# Altium project LCLP_DLog_V7.PrjPcb (part 1 of 2)
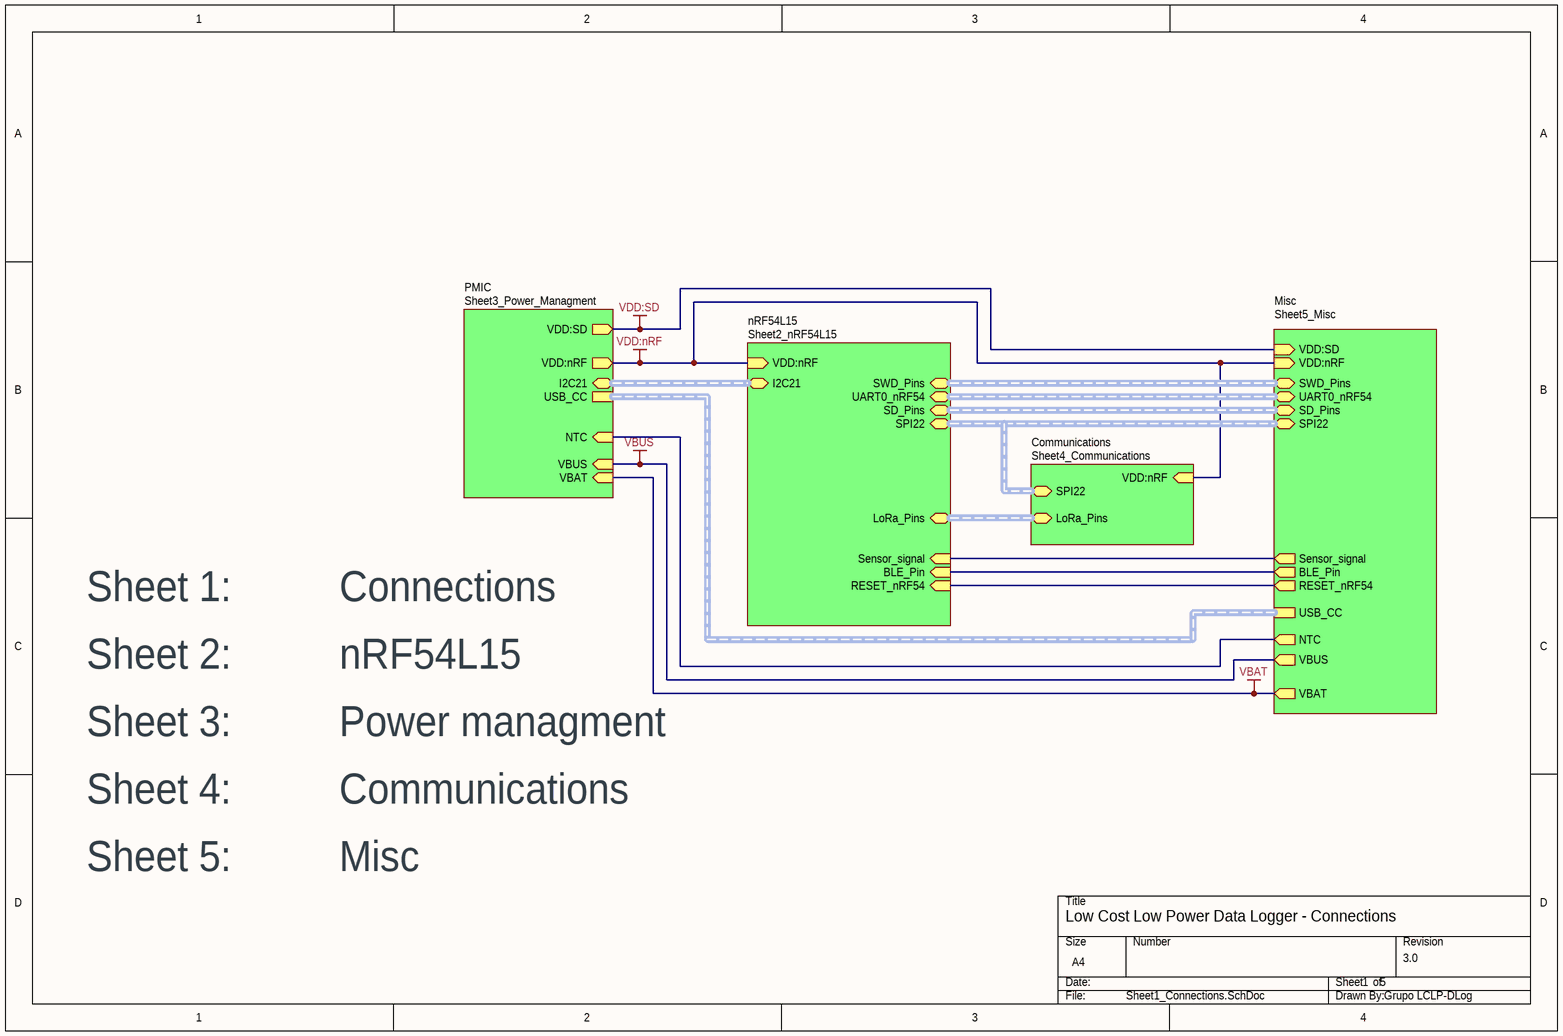
[diagram p0: Sheet1_Connections.SchDoc]
5 sheets, 67 parts. Net scope: hierarchical (ports join the sheet entries above them; power ports are global).
Board file: PCBV2.PcbDoc
Sheets:
  Sheet1_Connections.SchDoc
    nRF54L15 = Sheet2_nRF54L15.SchDoc
    PMIC = Sheet3_Power_Managment.SchDoc
    Communications = Sheet4_Communications.SchDoc
    Misc = Sheet5_Misc.SchDoc

## Sheet Sheet1_Connections.SchDoc
size A4; SheetNumber: 1; SheetTotal: 5

### Sub-sheets
Communications = Sheet4_Communications: SPI22 (bidir), LoRa_Pins (bidir), VDD:nRF (in)
Misc = Sheet5_Misc: SWD_Pins (bidir), UART0_nRF54 (bidir), SD_Pins (bidir), RESET_nRF54 (out), SPI22 (bidir), BLE_Pin (out), Sensor_signal (out), USB_CC, NTC (out), VBUS (out), VBAT (out), VDD:nRF (in), VDD:SD (in)
nRF54L15 = Sheet2_nRF54L15: I2C21 (bidir), SPI22 (bidir), LoRa_Pins (bidir), SD_Pins (bidir), UART0_nRF54 (bidir), SWD_Pins (bidir), RESET_nRF54 (in), Sensor_signal (in), BLE_Pin (in), VDD:nRF (in)
PMIC = Sheet3_Power_Managment: I2C21 (bidir), USB_CC, NTC (in), VBUS (in), VBAT (in), VDD:nRF (out), VDD:SD (out)

### Nets
VBAT: sheet PMIC/VBAT, sheet Misc/VBAT
VBUS: sheet PMIC/VBUS, sheet Misc/VBUS
VDD:nRF: sheet nRF54L15/VDD:nRF, sheet PMIC/VDD:nRF, sheet Communications/VDD:nRF, sheet Misc/VDD:nRF
VDD:SD: sheet PMIC/VDD:SD, sheet Misc/VDD:SD
nRF54_RESET: sheet nRF54L15/RESET_nRF54, sheet Misc/RESET_nRF54
NTC_IN: sheet PMIC/NTC, sheet Misc/NTC
P0.04: sheet nRF54L15/Sensor_signal, sheet Misc/Sensor_signal
P1.13: sheet nRF54L15/BLE_Pin, sheet Misc/BLE_Pin

### Buses and harness runs
harness sheet Communications/LoRa_Pins = sheet nRF54L15/LoRa_Pins
harness sheet Communications/SPI22 = sheet Misc/SPI22 = sheet nRF54L15/SPI22
harness sheet Misc/SD_Pins = sheet nRF54L15/SD_Pins
harness sheet Misc/SWD_Pins = sheet nRF54L15/SWD_Pins
harness sheet Misc/UART0_nRF54 = sheet nRF54L15/UART0_nRF54
harness sheet Misc/USB_CC = sheet PMIC/USB_CC
harness sheet nRF54L15/I2C21 = sheet PMIC/I2C21

### Notes on the sheet
- Sheet 1:          Connections
- Sheet 2:          nRF54L15
- Sheet 3:          Power managment
- Sheet 4:          Communications
- Sheet 5:          Misc
- Low Cost Low Power Data Logger - Connections
- 1
- 5
- 3.0
- Grupo LCLP-DLog

## Sheet Sheet2_nRF54L15.SchDoc
size A4; SheetNumber: 2; SheetTotal: 5
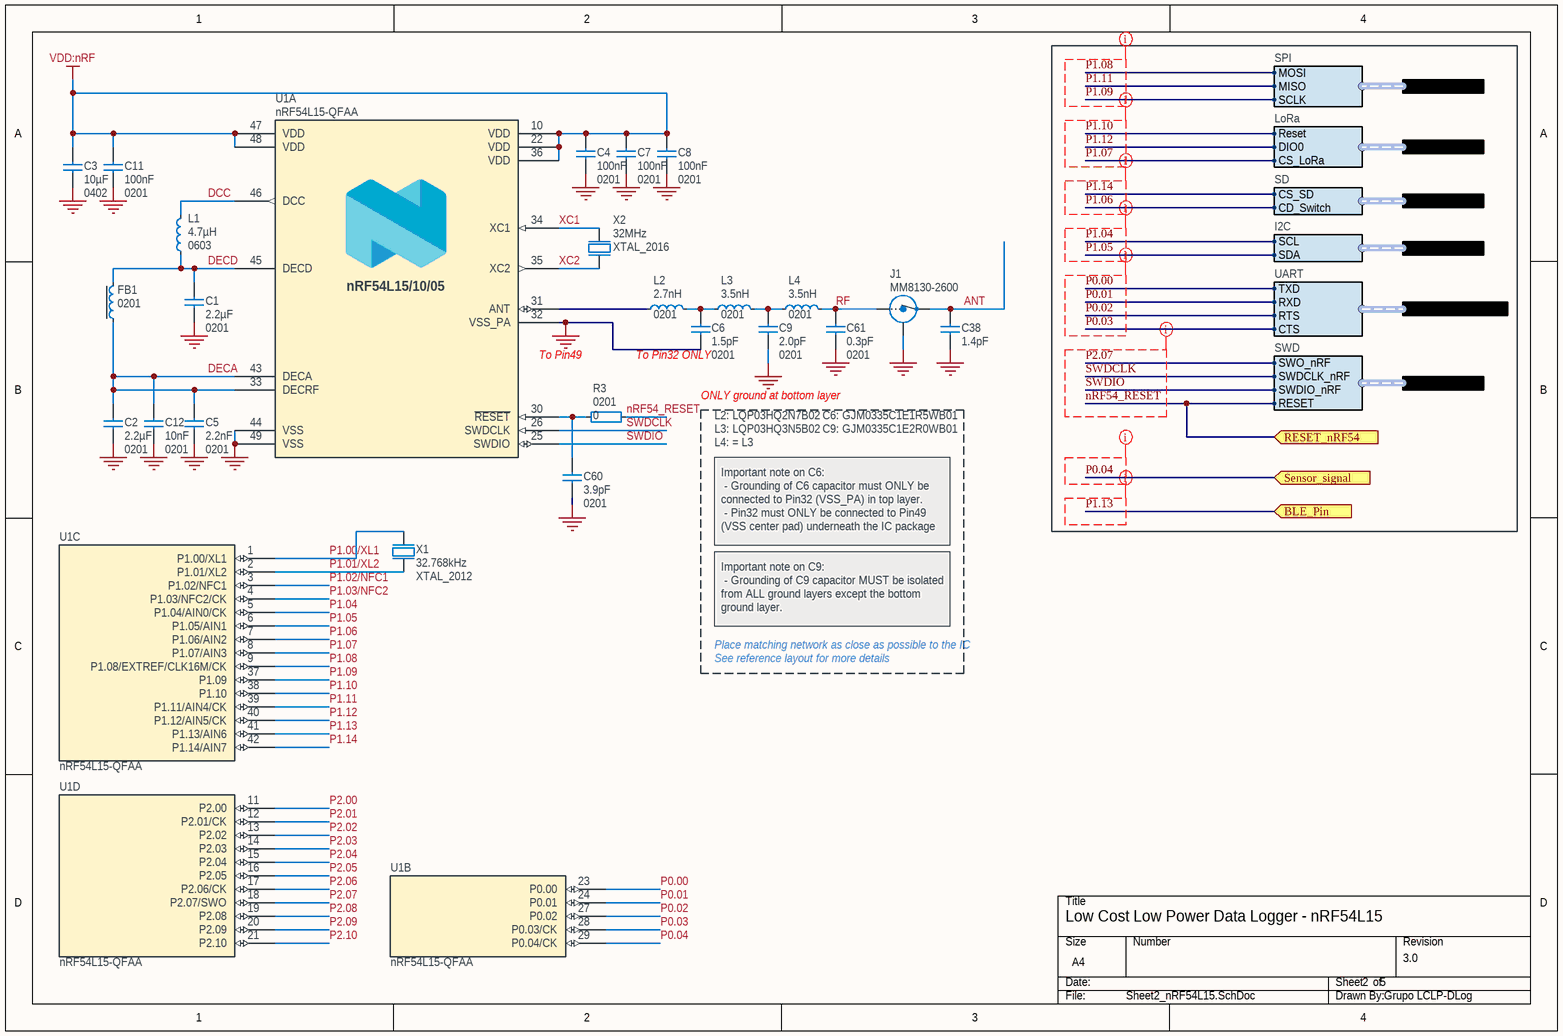
[diagram p1: Sheet2_nRF54L15.SchDoc]

### Parts
C1  2.2µF  Footprint Doc: 0201  [CAPC0603X03L_C]
C2  2.2µF  Footprint Doc: 0201  [CAPC0603X03L_C]
C3  10µF  Footprint Doc: 0402  [CAPC1005X04L]
C4  100nF  Footprint Doc: 0201  [CAPC0603X03L_C]
C5  2.2nF  Footprint Doc: 0201  [CAPC0603X03L_C]
C6  1.5pF  Footprint Doc: 0201  [CAPC0603X03L_C]
C7  100nF  Footprint Doc: 0201  [CAPC0603X03L_C]
C8  100nF  Footprint Doc: 0201  [CAPC0603X03L_C]
C9  2.0pF  Footprint Doc: 0201  [CAPC0603X03L_C]
C11  100nF  Footprint Doc: 0201  [CAPC0603X03L_C]
C12  10nF  Footprint Doc: 0201  [CAPC0603X03L_C]
C38  1.4pF  [CAPC0603X03L_C]
C60  3.9pF  Footprint Doc: 0201  [CAPC0603X03L_C]
C61  0.3pF  Footprint Doc: 0201  [CAPC0603X03L_C]
FB1  Footprint Doc: 0201  [INDC0603X03L_C]  (hidden comment: 120R/0.2A)
J1  MM8130-2600  [COAXIAL-SWF]
L1  4.7µH  Footprint Doc: 0603  [INDC1608X06L]
L2  2.7nH  Footprint Doc: 0201  [INDC0603X03L_C]
L3  3.5nH  Footprint Doc: 0201  [INDC0603X03L_C]
L4  3.5nH  Footprint Doc: 0201  [INDC0603X03L_C]
R3  0  Footprint Doc: 0201  [RESC0603X03L_C]
U1  nRF54L15-QFAA  [QFN40P600X600X90-48N]  (parts A,B,C,D of 4)
X1  32.768kHz  [XTAL_2012]
X2  32MHz  Footprint Doc: XTAL_2016  [BT-XTAL_2016]

### Ports
BLE_Pin (in, see Sheet1_Connections[3C], Sheet5_Misc[1C]), I2C21 (harness I2C, see Sheet1_Connections[2B], Sheet3_Power_Managment[1C]), LoRa_Pins (harness LoRa, see Sheet1_Connections[3C], Sheet4_Communications[2B]), RESET_nRF54 (in, see Sheet1_Connections[3C], Sheet5_Misc[1C]), SD_Pins (harness SD, see Sheet1_Connections[3B], Sheet5_Misc[2B]), Sensor_signal (in, see Sheet1_Connections[3C], Sheet5_Misc[1D]), SPI22 (harness SPI, see Sheet1_Connections[3B], Sheet4_Communications[2B], Sheet5_Misc[2A]), SWD_Pins (harness SWD, see Sheet1_Connections[3B], Sheet5_Misc[3A]), UART0_nRF54 (harness UART, see Sheet1_Connections[3B], Sheet5_Misc[2C])

### Harnesses
SPI: MISO, MOSI, SCLK
LoRa: DIO0, Reset, CS_LoRa
SD: CD_Switch, CS_SD
UART: RXD, TXD, RTS, CTS
I2C: SDA, SCL
SWD: SWDIO_nRF, SWDCLK_nRF, SWO_nRF, RESET

### Nets
GND: C1.1 C2.1 C3.1 C4.2 C5.1 C6.1 C7.2 C8.2 C9.1 C11.2 C12.1 C38.1 C60.1 C61.1 J1.2(Shield) U1.32(VSS_PA) U1.44(VSS) U1.49(VSS) X2.2(GND) X2.4(GND)
VDD:nRF: C3.2 C4.1 C7.1 C8.1 C11.1 U1.10(VDD) U1.22(VDD) U1.36(VDD) U1.47(VDD) U1.48(VDD)
ANT: C38.2 J1.3(OUT)
DCC: L1.1 U1.46(DCC)
DECA: C2.2 C5.2 C12.2 FB1.2 U1.33(DECRF) U1.43(DECA)
DECD: C1.2 FB1.1 L1.2 U1.45(DECD)
nRF54_RESET: R3.2 ; port RESET_nRF54, port SWD_Pins.RESET
P0.00: U1.23(P0.00) ; port UART0_nRF54.TXD
P0.01: U1.24(P0.01) ; port UART0_nRF54.RXD
P0.02: U1.27(P0.02) ; port UART0_nRF54.RTS
P0.03: U1.28(P0.03/CK) ; port UART0_nRF54.CTS
P0.04: U1.29(P0.04/CK) ; port Sensor_signal
P1.00/XL1: U1.1(P1.00/XL1) X1.2(out)
P1.01/XL2: U1.2(P1.01/XL2) X1.1(inp)
P1.02/NFC1: U1.3(P1.02/NFC1)
P1.03/NFC2: U1.4(P1.03/NFC2/CK)
P1.04: U1.5(P1.04/AIN0/CK) ; port I2C21.SCL
P1.05: U1.6(P1.05/AIN1) ; port I2C21.SDA
P1.06: U1.7(P1.06/AIN2) ; port SD_Pins.CD_Switch
P1.07: U1.8(P1.07/AIN3) ; port LoRa_Pins.CS_LoRa
P1.08: U1.9(P1.08/EXTREF/CLK16M/CK) ; port SPI22.MOSI
P1.09: U1.37(P1.09) ; port SPI22.SCLK
P1.10: U1.38(P1.10) ; port LoRa_Pins.Reset
P1.11: U1.39(P1.11/AIN4/CK) ; port SPI22.MISO
P1.12: U1.40(P1.12/AIN5/CK) ; port LoRa_Pins.DIO0  [project net DIO0_LoRa]
P1.13: U1.41(P1.13/AIN6) ; port BLE_Pin
P1.14: U1.42(P1.14/AIN7) ; port SD_Pins.CS_SD
P2.00: U1.11(P2.00)
P2.01: U1.12(P2.01/CK)
P2.02: U1.13(P2.02)
P2.03: U1.14(P2.03)
P2.04: U1.15(P2.04)
P2.05: U1.16(P2.05)
P2.06: U1.17(P2.06/CK)
P2.07: U1.18(P2.07/SWO) ; port SWD_Pins.SWO_nRF
P2.08: U1.19(P2.08)
P2.09: U1.20(P2.09)
P2.10: U1.21(P2.10)
RF: C61.2 J1.1(IN) L4.2
SWDCLK: U1.26(SWDCLK) ; port SWD_Pins.SWDCLK_nRF
SWDIO: U1.25(SWDIO) ; port SWD_Pins.SWDIO_nRF
XC1: U1.34(XC1) X2.1(inp)
XC2: U1.35(XC2) X2.3(out)
NetC6_2: C6.2 L2.2 L3.1
NetC9_2: C9.2 L3.2 L4.1
NetC60_2: C60.2 R3.1 U1.30(~{RESET})
NetL2_1: L2.1 U1.31(ANT)

### Layout directives
net class BUTTONS: nRF54_RESET, P0.00, P0.01, P0.02, P0.03, P0.04, P1.04, P1.05, P1.06, P1.07, P1.08, P1.09, P1.10, P1.11, P1.12, P1.13, P1.14, P2.07, SWDCLK, SWDIO

### Notes on the sheet
- (near U1) To Pin49
- (near C6) To Pin32 ONLY
- ONLY ground at bottom layer
- L2: LQP03HQ2N7B02
- L3: LQP03HQ3N5B02
- L4: = L3
- C6: GJM0335C1E1R5WB01
- C9: GJM0335C1E2R0WB01
- Important note on C6:
  - Grounding of C6 capacitor must ONLY be connected to Pin32 (VSS_PA) in top layer.
  - Pin32 must ONLY be connected to Pin49 (VSS center pad) underneath the IC package
- Place matching network as close as possible to the IC
- Important note on C9:
  - Grounding of C9 capacitor MUST be isolated from ALL ground layers except the bottom ground layer.
- See reference layout for more details
- Low Cost Low Power Data Logger - nRF54L15
- 2
- 5
- 3.0
- Grupo LCLP-DLog
- (in symbol nRF54L15-QFAAC00, part A) nRF54L15/10/05

### Library data of the parts
C1 C2 = C0201-2µ2-2.5V-X6T-GRM033D80E225ME47D: Capacitor, Ceramic, 2.2µF 2.5V X6T 0201,±20%; Manufacturer: Murata; Manufacturer Part Number: GRM033R61A225KE47; Part number NEMS: 100200527; Component Status: Active; Pad Count: 2; Note: 2.5V, 20%, X6T; Artikkelnr Noca: N.A.; Part Number: C0201-2µ2-2.5V-X6T-GRM033D80E225ME47D; Component Class: Capacitors; Author: stl1; ComponentLink1URL: https://www.murata.com/products/productdetail?partno=GRM033D80E225ME47%23; ComponentLink1Description: Datasheet; ComponentLink2URL: N.A.; ComponentLink2Description: Supplier link; HelpURL: N.A.; LatestRevisionDate: 2022-02-27; Published: 2022-02-27; Value: 2.2µF; Supplier 1: Mouser; Supplier Part Number 1: 81-GRM033D80E225ME7D; Supplier 2: Digi-Key; Supplier Part Number 2: 490-18653-1-ND; Part number IPS: N.A.; Part number Norautron: N.A.; PartId: 100200527
C3 = C0402-10µF-6.3V-X6S: Capacitor, X6S, ±20%, 6.3V; Manufacturer: N.A.; Part number NEMS: 100200478; Component Status: Active; Pad Count: 2; Part Number: C0402-10µF-6.3V-X6S; PartId: 100200478; Component Class: Capacitors; Author: getr; Manufacturer Part Number: N.A.; ComponentLink1URL: N.A.; ComponentLink1Description: Datasheet; ComponentLink2URL: N.A.; ComponentLink2Description: Supplier link; HelpURL: N.A.; LatestRevisionDate: 2021-06-25; Published: 2021-06-25; Value: 10µF; Note: 6.3V; Supplier 1: N.A.; Supplier Part Number 1: N.A.; Supplier 2: N.A.; Supplier Part Number 2: N.A.; Artikkelnr Noca: N.A.; Part number IPS: N.A.; Part number Norautron: N.A.
C4 C7 C8 C11 = C0201-100n-10V-X7R: Capacitor, X7R, ±10%; Manufacturer: N.A.; Part number NEMS: 100200469; Note: 10V; Pad Count: 2; Component Status: Active; Part Number: C0201-100n-10V-X7R; Manufacturer Part Number: N.A.; LatestRevisionDate: 2021-04-12; Published: 2021-04-12; Value: 100nF; Artikkelnr Noca: N.A.; Part number IPS: N.A.; ComponentLink1URL: N.A.; ComponentLink1Description: Datasheet; ComponentLink2URL: N.A.; ComponentLink2Description: Supplier link; HelpURL: N.A.; Supplier 1: N.A.; Supplier Part Number 1: N.A.; Supplier 2: N.A.; Supplier Part Number 2: N.A.; Component Class: Capacitors; Author: getr; Part number Norautron: N.A.; PartId: 100200469
C5 = C0201-2n2: Capacitor, X7R, ±10%, 10V; Manufacturer: N.A.; Part number IPS: 00000001778; Part number Norautron: 26470002; Part number NEMS: 100200060; Component Status: Active; Pad Count: 2; Part Number: C0201-2n2; PartId: 100200060; Component Class: Capacitors; Author: rsk; Manufacturer Part Number: N.A.; ComponentLink1URL: N.A.; ComponentLink1Description: Datasheet; ComponentLink2URL: N.A.; ComponentLink2Description: Supplier link; HelpURL: N.A.; LatestRevisionDate: 2014-11-13; Published: 2014-11-13; Value: 2.2nF; Note: 10V; Supplier 1: N.A.; Supplier Part Number 1: N.A.; Supplier 2: N.A.; Supplier Part Number 2: N.A.; Artikkelnr Noca: N.A.
C6 = C0201-1.5p-25V-NP0-GJM0335C1E1R5WB01: Capacitor, NP0, ±0.05pF, 25V, High Q; Manufacturer: Murata; Part number NEMS: 100200477; Component Status: Active; Pad Count: 2; Artikkelnr Noca: N.A.; Part Number: C0201-1.5p-25V-NP0-GJM0335C1E1R5WB01; PartId: 100200477; Component Class: Capacitors; Author: masi; Manufacturer Part Number: GJM0335C1E1R5WB01; ComponentLink1URL: https://search.murata.co.jp/Ceramy/image/img/A01X/G101/ENG/GJM0335C1E1R5WB01-01.pdf; ComponentLink1Description: Datasheet; ComponentLink2URL: N.A.; ComponentLink2Description: Supplier link; HelpURL: https://www.murata.com/products/productdetail?partno=GJM0335C1E1R5WB01%23; LatestRevisionDate: 2021-06-15; Published: 2021-06-15; Value: 1.5pF; Note: 25V; Supplier 1: Digi-Key; Supplier Part Number 1: 490-11176-2-ND; Supplier 2: Mouser; Supplier Part Number 2: 81-GJM0335C1E1R5WB1D; Part number IPS: N.A.; Part number Norautron: N.A.
C9 = C0201-2.0p-HQ-Murata: Capacitor, NP0, ±0.05pF, 25V; Manufacturer: Murata; Manufacturer Part Number: GJM0335C1E2R0WB01; Part number IPS: 00000001775; Part number NEMS: 100200419; Component Status: Active; Pad Count: 2; Artikkelnr Noca: N.A.; Part Number: C0201-2.0p-HQ-Murata; PartId: 100200419; Component Class: Capacitors; Author: rsk; ComponentLink1URL: N.A.; ComponentLink1Description: Datasheet; ComponentLink2URL: N.A.; ComponentLink2Description: Supplier link; HelpURL: https://psearch.en.murata.com/capacitor/product/GJM0335C1E2R0WB01%23.html; LatestRevisionDate: 2018-10-25; Published: 2018-10-25; Value: 2.0pF; Note: 25V; Supplier 1: N.A.; Supplier Part Number 1: N.A.; Supplier 2: N.A.; Supplier Part Number 2: N.A.; Part number Norautron: N.A.
C12 = C0201-10n-6.3V-X7R: Capacitor, X7R, 6.3V; Manufacturer: Murata; Manufacturer Part Number: GRM033R70J103KA01D; Part number NEMS: 100200407; Component Status: Active; Pad Count: 2; Artikkelnr Noca: N.A.; Part Number: C0201-10n-6.3V-X7R; PartId: 100200407; Component Class: Capacitors; Author: rsk; ComponentLink1URL: http://search.murata.co.jp/Ceramy/image/img/A01X/G101/ENG/GRM033R70J103KA01-01.pdf; ComponentLink1Description: Datasheet; ComponentLink2URL: N.A.; ComponentLink2Description: Supplier link; HelpURL: N.A.; LatestRevisionDate: 2020-10-13; Published: 2018-05-07; Value: 10nF; Note: 6.3V; Supplier 1: Digi-Key; Supplier Part Number 1: 490-1262-1-ND; Supplier 2: N.A.; Supplier Part Number 2: N.A.; Part number IPS: N.A.; Part number Norautron: N.A.
C38 = C0201-1.4p-25V-GJM0335C1E1R4WB01D: Capacitor, C0G, ±0.05pF, 25V; Manufacturer: Murata; Part number NEMS: 100200553; Pad Count: 2; Artikkelnr Noca: N.A.; Component Status: Active; Part Number: C0201-1.4p-25V-GJM0335C1E1R4WB01D; PartId: 100200553; Component Class: Capacitors; Author: stl1; Manufacturer Part Number: GJM0335C1E1R4WB01D; ComponentLink1URL: https://www.murata.com/products/productdetail?partno=GJM0335C1E1R4WB01%23; ComponentLink1Description: Datasheet; ComponentLink2URL: N.A.; ComponentLink2Description: Supplier link; HelpURL: N.A.; Footprint Doc: 0201; LatestRevisionDate: 2023-05-30; Published: 2023-05-30; Value: 1.4pF; Note: 25V; Supplier 1: Digi-Key; Supplier Part Number 1: 490-GJM0335C1E1R4WB01DTR-ND; Supplier 2: Mouser; Supplier Part Number 2: 81-GJM0335C1E1R4WB1D; Part number IPS: N.A.; Part number Norautron: N.A.
C60 = C0201-3.9p: Chip Cap 0201; Manufacturer: N.A.; Part number NEMS: 100200024; Component Status: Active; Pad Count: 2; Note: Chip Cap 1%; Part Number: C0201-3.9p; PartId: 100200024; Component Class: Capacitors; Author: rsk; Manufacturer Part Number: N.A.; ComponentLink1URL: N.A.; ComponentLink1Description: Datasheet; ComponentLink2URL: N.A.; ComponentLink2Description: Supplier link; HelpURL: N.A.; LatestRevisionDate: 2014-11-13; Published: 2014-11-13; Value: 3.9pF; Supplier 1: N.A.; Supplier Part Number 1: N.A.; Supplier 2: N.A.; Supplier Part Number 2: N.A.; Artikkelnr Noca: N.A.; Part number IPS: N.A.; Part number Norautron: N.A.
C61 = C0201-0.3p-50V-GRM0335C1HR30BA01: Capacitor, C0G, ±0.1pF, 50V; Manufacturer: Murata; Part number NEMS: 100200650; Component Status: Active; Pad Count: 2; Artikkelnr Noca: N.A.; Part Number: C0201-0.3p-50V-GRM0335C1HR30BA01; PartId: 100200650; Component Class: Capacitors; Author: masi; Manufacturer Part Number: GRM0335C1HR30BA01; ComponentLink1URL: https://www.murata.com/en-global/products/productdetail?partno=GRM0335C1HR30BA01%23; ComponentLink1Description: Datasheet; ComponentLink2URL: N.A.; ComponentLink2Description: Supplier link; HelpURL: N.A.; LatestRevisionDate: 2024-01-10; Published: 2024-01-10; Value: 0.3pF; Note: 50V; Supplier 1: Digi-Key; Supplier Part Number 1: 490-6135-2-ND; Supplier 2: Mouser; Supplier Part Number 2: 81-GRM0335C1HR30BA1D; Part number IPS: N.A.; Part number Norautron: N.A.
FB1 = FB0201-120R@100M-200mA-BLM03AG121SN1D: Ferrite Bead, 120 Ohm @ 100MHz, 200mA, 500 mOhm Max; Manufacturer: Murata; Part number NEMS: 100300419; Component Status: Active; Pad Count: 2; Artikkelnr Noca: N.A.; Part Number: FB0201-120R@100M-200mA-BLM03AG121SN1D; Component Class: Inductors; Author: stl1; Manufacturer Part Number: BLM03AG121SN1D; ComponentLink1URL: https://www.murata.com/en-eu/products/productdetail?partno=BLM03AG121SN1%23; ComponentLink1Description: Datasheet; ComponentLink2URL: N.A.; ComponentLink2Description: Supplier link; HelpURL: N.A.; LatestRevisionDate: 2022-02-27; Published: 2022-02-27; Value: 120R/0.2A; Note: Ferrite Bead; Supplier 1: Digi-Key; Supplier Part Number 1: 490-5622-1-ND; Supplier 2: Mouser; Supplier Part Number 2: 81-BLM03AX121SN1D; Part number IPS: N.A.; Part number Norautron: N.A.; PartId: 100300419
J1 = MM8130-2600: Coaxial Connector with Switch; Manufacturer: Murata; Part number IPS: 00000009955; Part number Norautron: 26030338; Part number NEMS: 100500400; Component Status: Active; Pad Count: 3; Note: N.A.; Artikkelnr Noca: 55029011; Part Number: MM8130-2600; PartId: 100500400; Component Class: Connectors; Author: rsk; Manufacturer Part Number: MM8130-2600; ComponentLink1URL: N.A.; ComponentLink1Description: Datasheet; ComponentLink2URL: N.A.; ComponentLink2Description: Supplier link; HelpURL: http://www.murata.com/products/catalog/pdf/o33e.pdf; LatestRevisionDate: 2014-04-24; Published: 2014-04-24; Footprint Doc: COAXIAL-SWF; Value: MM8130-2600; Supplier 1: Digi-Key; Supplier Part Number 1: 490-4981-1-ND; Supplier 2: Mouser; Supplier Part Number 2: 81-MM8130-2600RA2; System: Connector
L1 = L0603-4µ7-MLZ1608M4R7WT000: Inductor, 120mA, ±20%, 0.65R; Manufacturer: TDK Corporation; Part number NEMS: 100300440; Component Status: Active; Pad Count: 2; Note: Power Inductor ±20%; Artikkelnr Noca: N.A.; Part Number: L0603-4µ7-MLZ1608M4R7WT000; PartId: 100300440; Component Class: Inductors; Author: stl1; Manufacturer Part Number: MLZ1608M4R7WT000; ComponentLink1URL: https://product.tdk.com/en/search/inductor/inductor/smd/info?part_no=MLZ1608M4R7WT000; ComponentLink1Description: Datasheet; ComponentLink2URL: N.A.; ComponentLink2Description: Supplier link; HelpURL: N.A.; LatestRevisionDate: 2023-05-10; Published: 2023-05-10; Value: 4.7µH; Supplier 1: Digi-Key; Supplier Part Number 1: 445-6390-2-ND; Supplier 2: Mouser; Supplier Part Number 2: 810-MLZ1608M4R7WT000; Part number IPS: N.A.; Part number Norautron: N.A.
L2 = L0201-2n7-HQ-Murata: Inductor, 600mA, ±0.1ｎH, 120mOhm; Manufacturer: Murata; Manufacturer Part Number: LQP03HQ2N7B02; Part number IPS: 00000001753; Part number NEMS: 100300214; Component Status: Active; Pad Count: 2; Note: -55°C ~ 125°C; Artikkelnr Noca: N.A.; Part Number: L0201-2n7-HQ-Murata; PartId: 100300214; Component Class: Inductors; Author: rsk; ComponentLink1URL: https://search.murata.co.jp/Ceramy/image/img/P02/JELF243C-0021.pdf; ComponentLink1Description: Datasheet; ComponentLink2URL: N.A.; ComponentLink2Description: Supplier link; HelpURL: https://psearch.en.murata.com/inductor/product/LQP03HQ2N7B02%23.html; LatestRevisionDate: 2018-10-23; Published: 2018-10-23; Value: 2.7nH; Supplier 1: Digi-Key; Supplier Part Number 1: 490-13909-1-ND; Supplier 2: N.A.; Supplier Part Number 2: N.A.; Part number Norautron: N.A.
L3 L4 = L0201-3n5-HQ-Murata: Inductor, 500mA, ±0.1ｎH, 170mOhm; Manufacturer: Murata; Manufacturer Part Number: LQP03HQ3N5B02; Part number NEMS: 100300222; Component Status: Active; Pad Count: 2; Note: -55°C ~ 125°C; Artikkelnr Noca: N.A.; Part Number: L0201-3n5-HQ-Murata; PartId: 100300222; Component Class: Inductors; Author: rsk; ComponentLink1URL: https://search.murata.co.jp/Ceramy/image/img/P02/JELF243C-0021.pdf; ComponentLink1Description: Datasheet; ComponentLink2URL: N.A.; ComponentLink2Description: Supplier link; HelpURL: https://psearch.en.murata.com/inductor/product/LQP03HQ3N5B02%23.html; LatestRevisionDate: 2018-10-23; Published: 2018-10-23; Value: 3.5nH; Supplier 1: Digi-Key; Supplier Part Number 1: 490-13925-1-ND; Supplier 2: N.A.; Supplier Part Number 2: N.A.; Part number IPS: N.A.; Part number Norautron: N.A.
R3 = R0201-1k0: Resistor, ±1%, 0.05W; Manufacturer: N.A.; Part number IPS: 00000005786; Part number NEMS: 100100043; Component Status: Active; Pad Count: 2; Value: 1k; Note: Chip Res 1%; Part Number: R0201-1k0; PartId: 100100043; Component Class: Resistors; Author: rsk; Manufacturer Part Number: N.A.; ComponentLink1URL: N.A.; ComponentLink1Description: Datasheet; ComponentLink2URL: N.A.; ComponentLink2Description: Supplier link; HelpURL: N.A.; LatestRevisionDate: 2014-11-13; Published: 2014-11-13; Supplier 1: N.A.; Supplier Part Number 1: N.A.; Supplier 2: N.A.; Supplier Part Number 2: N.A.; Artikkelnr Noca: N.A.; Part number Norautron: N.A.
U1 = nRF54L15-QFAAC00: Multi-protocol Bluetooth Low Energy, IEEE 802.15.4 and 2.4GHz proprietary Wireless MCU; Manufacturer: Nordic Semiconductor; Part number NEMS: 102000382; Component Status: Active; Pad Count: 49; Note: N.A.; Part Number: nRF54L15-QFAAC00; Component Class: Nordic_Devices; Author: stl1; Manufacturer Part Number: nRF54L15-QFAAC00; ComponentLink1URL: N.A.; ComponentLink1Description: Datasheet; ComponentLink2URL: N.A.; ComponentLink2Description: Supplier link; HelpURL: N.A.; LatestRevisionDate: 2025-01-30; Published: 2025-01-30; Footprint Doc: QFN-48; Value: nRF54L15-QFAA; Supplier 1: Nordic Semiconductor; Supplier Part Number 1: nRF54L15-QFAAC00; Supplier 2: N.A.; Supplier Part Number 2: N.A.; Artikkelnr Noca: N.A.; Part number IPS: N.A.; Part number Norautron: N.A.; PartId: 102000382
X1 = XTAL_SMD2012_32.768kHz_9pF_TXC: XTAL SMD 2012, 32.768kHz, 9pF, ±20ppm; Manufacturer: TXC Corporation; Manufacturer Part Number: 9HT11-32.768KDZC-T; Part number NEMS: 101600107; Component Status: Active; Pad Count: 2; Note: XTAL SMD 32.768kHz; Artikkelnr Noca: N.A.; Part Number: XTAL_SMD2012_32.768kHz_9pF_TXC; PartId: 101600107; Component Class: Oscillators; Author: eisk; ComponentLink1URL: http://www.txccrystal.com/images/pdf/9ht11.pdf; ComponentLink1Description: Datasheet; ComponentLink2URL: https://www.digikey.com/en/products/detail/9HT11-32.768KDZC-T/887-1426-1-ND/2403277; ComponentLink2Description: Supplier link; HelpURL: http://www.txccrystal.com/images/pdf/9ht11.pdf; LatestRevisionDate: 2023-03-14; Published: 2014-03-28; Footprint Doc: XTAL_2012; Value: 32.768kHz; Supplier 1: Digi-Key; Supplier Part Number 1: 887-1426-2-ND; Supplier 2: Mouser; Supplier Part Number 2: 717-9HT11-32.7KDZC-T; Part number IPS: N.A.; Part number Norautron: N.A.
X2 = XTAL_SMD2016_32MHz_8pF_Kyocera: XTAL SMD 2016, 32MHz, Cl=8pF, Tot: ±40ppm; Manufacturer Part Number: CX2016DB32000D0WZRC1; Part number IPS: 00000007827; Part number Norautron: 26511136; Part number NEMS: 101600039; Component Status: Active; Pad Count: 4; Note: XTAL SMD 32.000MHz; Artikkelnr Noca: 22010022; Part Number: XTAL_SMD2016_32MHz_8pF_Kyocera; PartId: 101600039; Component Class: Oscillators; Author: rsk; Manufacturer: Kyocera; ComponentLink1URL: N.A.; ComponentLink1Description: Datasheet; ComponentLink2URL: N.A.; ComponentLink2Description: Supplier link; HelpURL: http://media.digikey.com/pdf/Data%20Sheets/AVX%20PDFs/CX2016DB32000D0WZRC1_Spec.pdf; LatestRevisionDate: 2016-06-02; Published: 2015-10-15; Value: 32MHz; Supplier 1: Digi-Key; Supplier Part Number 1: 1253-1586-1-ND; Supplier 2: N.A.; Supplier Part Number 2: N.A.

## Sheet Sheet3_Power_Managment.SchDoc
size A4; SheetNumber: 3; SheetTotal: 5
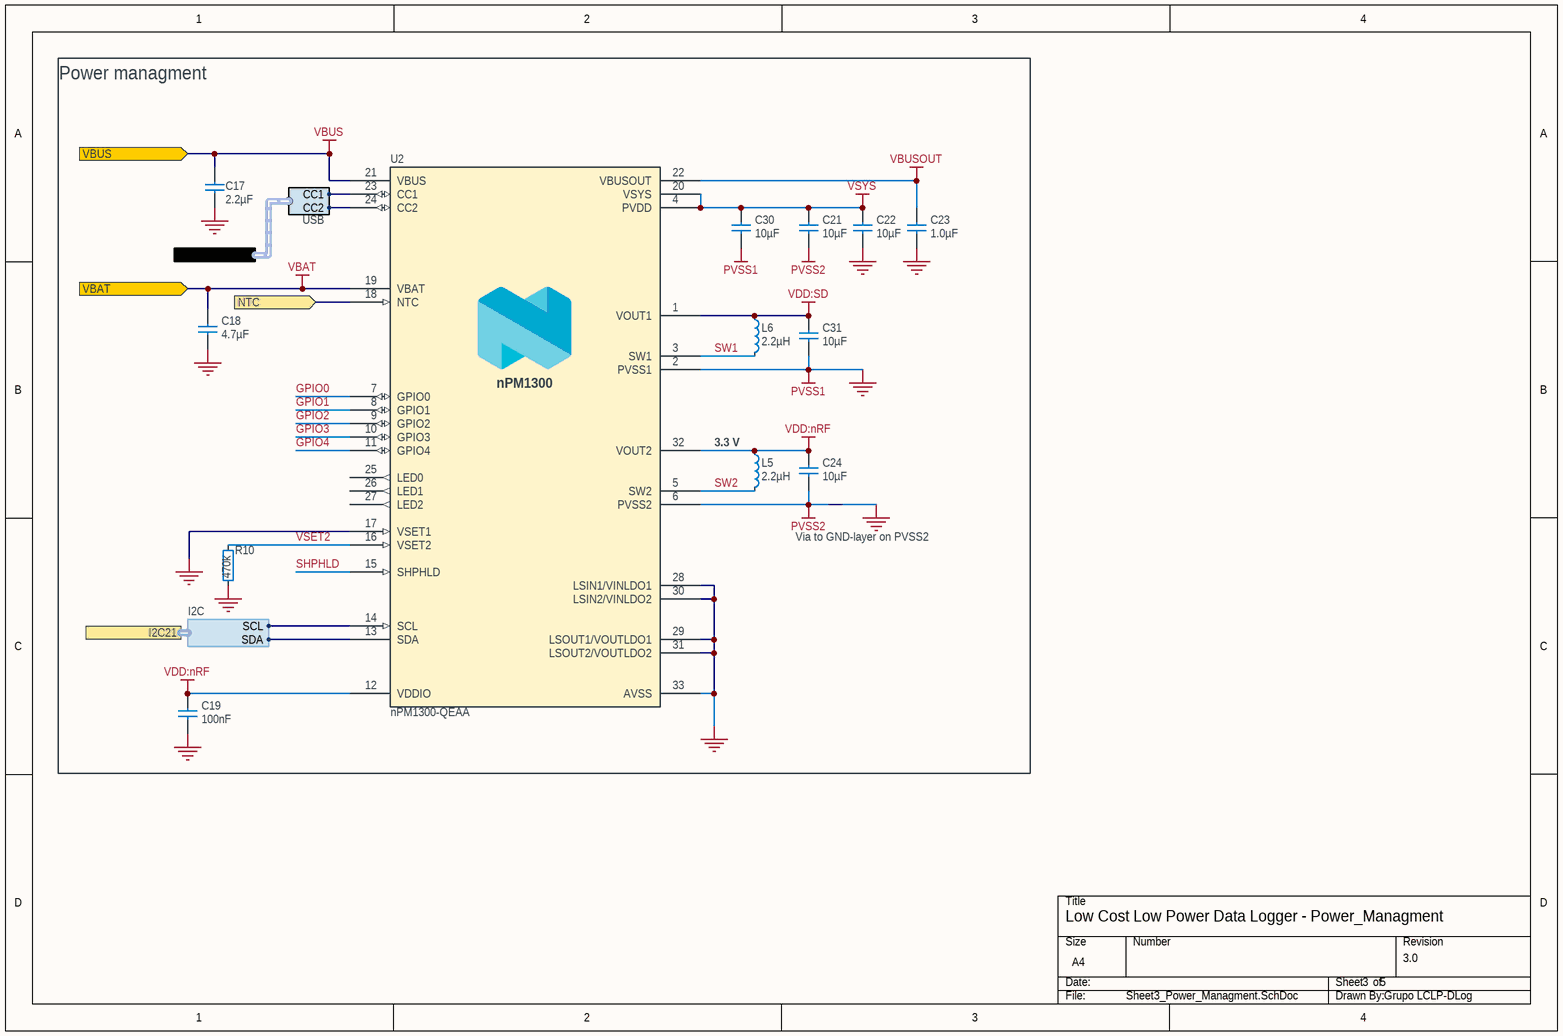
[diagram p2: Sheet3_Power_Managment.SchDoc]

### Parts
C17  2.2µF  [CAPC1005X04L]
C18  4.7µF  [CAPC1608X06L]
C19  100nF  [CAPC0603X03L_C]
C21  10µF  [CAPC1608X06L]
C22  10µF  [CAPC1608X06L]
C23  1.0µF  [CAPC1608X06L]
C24  10µF  [CAPC1608X06L]
C30  10µF  [CAPC1608X06L]
C31  10µF  [CAPC1608X06L]
L5  2.2µH  [INDC2016X10N]
L6  2.2µH  [INDC2016X10N]
R10  470k  [RESC0603X03L_C]
U2  nPM1300-QEAA  [Nordic_QFN50P500X500X90-33N]

### Ports
I2C21 (harness I2C, see Sheet1_Connections[2B], Sheet2_nRF54L15[4A]), NTC (in, see Sheet1_Connections[2B], Sheet5_Misc[2D]), USB_CC (harness USB, see Sheet1_Connections[2B], Sheet5_Misc[4C]), VBAT (in, see Sheet1_Connections[2B], Sheet5_Misc[2D]), VBUS (in, see Sheet1_Connections[2B], Sheet5_Misc[4C])

### Harnesses
I2C: SDA, SCL
USB: CC2, CC1

### Nets
GND: C17.1 C18.1 C19.2 C21.1 C22.1 C23.1 C24.1 C30.1 C31.1 R10.2 U2.2(PVSS1) U2.6(PVSS2) U2.17(VSET1) U2.28(LSIN1/VINLDO1) U2.29(LSOUT1/VOUTLDO1) U2.30(LSIN2/VINLDO2) U2.31(LSOUT2/VOUTLDO2) U2.33(AVSS)  [also labelled PVSS1, PVSS2]
VBAT: C18.2 U2.19(VBAT) ; port VBAT
VBUS: C17.2 U2.21(VBUS) ; port VBUS
VBUSOUT: C23.2 U2.22(VBUSOUT)
VDD:nRF: C19.1 C24.2 L5.1 U2.12(VDDIO) U2.32(VOUT2)
VDD:SD: C31.2 L6.1 U2.1(VOUT1)
VSYS: C21.2 C22.2 C30.2 U2.4(PVDD) U2.20(VSYS)
GPIO0: U2.7(GPIO0)
GPIO1: U2.8(GPIO1)
GPIO2: U2.9(GPIO2)
GPIO3: U2.10(GPIO3)
GPIO4: U2.11(GPIO4)
NTC_IN: U2.18(NTC) ; port NTC
P1.04: U2.14(SCL) ; port I2C21.SCL
P1.05: U2.13(SDA) ; port I2C21.SDA
SHPHLD: U2.15(SHPHLD)
SW1: L6.2 U2.3(SW1)
SW2: L5.2 U2.5(SW2)
VSET2: R10.1 U2.16(VSET2)
NetJ4_A5: U2.23(CC1) ; port USB_CC.CC1
NetJ4_B5: U2.24(CC2) ; port USB_CC.CC2

Not connected (* = marked no-connect by the designer): U2 25(LED0) 26(LED1) 27(LED2)

### Notes on the sheet
- Power managment
- (near L5) 3.3 V
- Via to GND-layer on PVSS2
- Low Cost Low Power Data Logger - Power_Managment
- 3
- 5
- 3.0
- Grupo LCLP-DLog
- (in symbol nPM1300-QEAA) nPM1300

### Library data of the parts
C17 = C0402-2µ2-10V: Capacitor, X5R, ±10%; Manufacturer: N.A.; Part number NEMS: 100200376; Component Status: Active; Pad Count: 2; Note: 10V; Part Number: C0402-2µ2-10V; PartId: 100200376; Component Class: Capacitors; Author: rsk; Manufacturer Part Number: N.A.; ComponentLink1URL: N.A.; ComponentLink1Description: Datasheet; ComponentLink2URL: N.A.; ComponentLink2Description: Supplier link; HelpURL: N.A.; LatestRevisionDate: 2020-10-13; Published: 2016-08-22; Footprint Doc: 0402; Value: 2.2µF; Supplier 1: Digi-Key; Supplier Part Number 1: 490-10451-1-ND; Supplier 2: N.A.; Supplier Part Number 2: N.A.; Artikkelnr Noca: N.A.; Part number IPS: N.A.; Part number Norautron: N.A.
C18 = C0603-4µ7-10V-X5R: Capacitor, Ceramic, X5R, ±10%, 10V; Manufacturer: N.A.; Part number Norautron: 262081761; Part number NEMS: 100200479; Component Status: Active; Pad Count: 2; Part Number: C0603-4µ7-10V-X5R; PartId: 100200479; Component Class: Capacitors; Author: rubr; Manufacturer Part Number: N.A.; ComponentLink1URL: N.A.; ComponentLink1Description: Datasheet; ComponentLink2URL: N.A.; ComponentLink2Description: Supplier link; HelpURL: N.A.; LatestRevisionDate: 2021-07-22; Published: 2021-07-22; Footprint Doc: 0603; Value: 4.7µF; Note: 10V; Supplier 1: N.A.; Supplier Part Number 1: N.A.; Supplier 2: N.A.; Supplier Part Number 2: N.A.; Artikkelnr Noca: N.A.; Part number IPS: N.A.
C19 = C0201-100n: Capacitor, X5R, ±10%, 100nF, 16V; Manufacturer: N.A.; Part number IPS: 00000001248, 00000002505; Part number Norautron: 262071862; Part number NEMS: 100200078; Pad Count: 2; Component Status: Active; Part Number: C0201-100n; PartId: 100200078; Component Class: Capacitors; Author: rsk; Manufacturer Part Number: N.A.; ComponentLink1URL: N.A.; ComponentLink1Description: Datasheet; ComponentLink2URL: N.A.; ComponentLink2Description: Supplier link; HelpURL: N.A.; Footprint Doc: 0201; LatestRevisionDate: 2024-06-27; Published: 2014-11-13; Value: 100nF; Note: 16V; Supplier 1: N.A.; Supplier Part Number 1: N.A.; Supplier 2: N.A.; Supplier Part Number 2: N.A.; Artikkelnr Noca: N.A.
C21 C22 C24 = C0603-10µ: Capacitor, X5R, ±20%; Manufacturer: N.A.; Part number IPS: 00000007785; Part number NEMS: 100200275; Note: 6.3V; Artikkelnr Noca: 20039234; Pad Count: 2; Component Status: Active; Part Number: C0603-10µ; Manufacturer Part Number: N.A.; ComponentLink1URL: N.A.; ComponentLink1Description: Datasheet; ComponentLink2URL: N.A.; ComponentLink2Description: Supplier link; HelpURL: N.A.; Footprint Doc: 0603; LatestRevisionDate: 2011-01-17; Published: 2011-01-17; Value: 10µF; Supplier 1: N.A.; Supplier Part Number 1: N.A.; Supplier 2: N.A.; Supplier Part Number 2: N.A.; Component Class: Capacitors; PartId: 100200275; Author: rsk; Part number Norautron: N.A.
C23 = C0603-1µ0-10V-X5R: Capacitor, Ceramic, 1.0µF 10V X5R 0603,±10%; Manufacturer: N.A.; Part number NEMS: 100200528; Component Status: Active; Pad Count: 2; Part Number: C0603-1µ0-10V-X5R; PartId: 100200528; Component Class: Capacitors; Author: getr; Manufacturer Part Number: N.A.; ComponentLink1URL: N.A.; ComponentLink1Description: Datasheet; ComponentLink2URL: N.A.; ComponentLink2Description: Supplier link; HelpURL: N.A.; LatestRevisionDate: 2022-10-06; Published: 2022-10-06; Footprint Doc: 0603; Value: 1.0µF; Note: 10V; Supplier 1: N.A.; Supplier Part Number 1: N.A.; Supplier 2: N.A.; Supplier Part Number 2: N.A.; Artikkelnr Noca: N.A.; Part number IPS: N.A.; Part number Norautron: N.A.
C30 C31 = C0603-10µ-25V-X5R-GRM188R61E106MA73J: Capacitor, Ceramic, X5R, ±20%, 25V; Manufacturer: Murata; Part number NEMS: 100200456; Artikkelnr Noca: N.A.; Pad Count: 2; Component Status: Active; Part Number: C0603-10µ-25V-X5R-GRM188R61E106MA73J; Manufacturer Part Number: GRM188R61E106MA73J; ComponentLink1URL: https://search.murata.co.jp/Ceramy/image/img/A01X/G101/ENG/GRM188R61E106MA73-01.pdf; ComponentLink1Description: Datasheet; ComponentLink2URL: https://www.murata.com/en-global/products/productdetail?partno=GRM188R61E106MA73%23; ComponentLink2Description: Supplier link; HelpURL: N.A.; Footprint Doc: 0603; LatestRevisionDate: 2021-07-22; Published: 2020-12-16; Value: 10µF; Note: 25V; Supplier 1: Digi-Key; Supplier Part Number 1: 490-12737-1-ND; Supplier 2: Mouser; Supplier Part Number 2: 81-GRM188R61E106MA3J; Part number IPS: N.A.; Component Class: Capacitors; PartId: 100200456; Author: rsk; Part number Norautron: N.A.
L5 = L0806-2µ2-2500mA-73mOhm-CIGT201610EH2R2MNE: Inductor, Irms=2.5A, Isat=2.9A, ±20%, DCR=73mΩ; Manufacturer: Samsung Electro-Mechanics America; Part number Norautron: 26521789; Part number NEMS: 100300400; Pad Count: 2; Note: Unshielded Thin Film Inductor; Artikkelnr Noca: N.A.; Component Status: Active; Part Number: L0806-2µ2-2500mA-73mOhm-CIGT201610EH2R2MNE; PartId: 100300400; Component Class: Inductors; Author: rsk; Manufacturer Part Number: CIGT201610EH2R2MNE; ComponentLink1URL: https://media.digikey.com/pdf/Data%20Sheets/Samsung%20PDFs/CIGT201610EH2R2MNE_Spec.pdf; ComponentLink1Description: Datasheet; ComponentLink2URL: https://www.digikey.com/en/products/detail/samsung-electro-mechanics/CIGT201610EH2R2MNE/7041223?s=N4IgTCBcDaIMIEkDiAVMAGAjANk%2BgogBJgBKYAsgHL4gC6AvkA; ComponentLink2Description: Supplier link; HelpURL: http://product.samsungsem.com/pi/CIGT201610EH2R2MN.do; Footprint Doc: 0806; LatestRevisionDate: 2022-09-07; Published: 2021-02-03; Value: 2.2µH; Supplier 1: Digi-Key; Supplier Part Number 1: 1276-6901-1-ND; Supplier 2: Mouser; Supplier Part Number 2: 187-CIGT201610EH2R2M; Part number IPS: N.A.
L6 = L0806-2µ2-2500mA-73mOhm-CIGT201610EH2R2MNE: Inductor, Irms=2.5A, Isat=2.9A, ±20%, DCR=73mΩ; Manufacturer: Samsung Electro-Mechanics; Part number Norautron: 26521789; Part number NEMS: 100300400; Pad Count: 2; Note: Unshielded Thin Film Inductor; Artikkelnr Noca: N.A.; Component Status: Active; Part Number: L0806-2µ2-2500mA-73mOhm-CIGT201610EH2R2MNE; PartId: 100300400; Component Class: Inductors; Author: rsk; Manufacturer Part Number: CIGT201610EH2R2MNE; ComponentLink1URL: https://media.digikey.com/pdf/Data%20Sheets/Samsung%20PDFs/CIGT201610EH2R2MNE_Spec.pdf; ComponentLink1Description: Datasheet; ComponentLink2URL: https://www.digikey.com/en/products/detail/samsung-electro-mechanics/CIGT201610EH2R2MNE/7041223?s=N4IgTCBcDaIMIEkDiAVMAGAjANk%2BgogBJgBKYAsgHL4gC6AvkA; ComponentLink2Description: Supplier link; HelpURL: http://product.samsungsem.com/pi/CIGT201610EH2R2MN.do; Footprint Doc: 0806; LatestRevisionDate: 2022-09-07; Published: 2021-02-03; Value: 2.2µH; Supplier 1: Digi-Key; Supplier Part Number 1: 1276-6901-1-ND; Supplier 2: Mouser; Supplier Part Number 2: 187-CIGT201610EH2R2M; Part number IPS: N.A.
R10 = R0201-150k: Resistor, ±1%, 0.05W; Manufacturer: N.A.; Part number IPS: 00000001422; Part number NEMS: 100100082; Component Status: Active; Pad Count: 2; Value: 150k; Note: Chip Res 1%; Part Number: R0201-150k; PartId: 100100082; Component Class: Resistors; Author: rsk; Manufacturer Part Number: N.A.; ComponentLink1URL: N.A.; ComponentLink1Description: Datasheet; ComponentLink2URL: N.A.; ComponentLink2Description: Supplier link; HelpURL: N.A.; LatestRevisionDate: 2014-11-13; Published: 2014-11-13; Footprint Doc: 0201; Supplier 1: N.A.; Supplier Part Number 1: N.A.; Supplier 2: N.A.; Supplier Part Number 2: N.A.; Artikkelnr Noca: N.A.; Part number Norautron: N.A.
U2 = nPM1300-QEAA: Li-Ion/Li-Polymer USB-C battery charger with high efficiency buck regulators, LDOs or load switches, LED drivers, TWI and VBUSOUT; Manufacturer: Nordic Semiconductor; Part number NEMS: 102000291; Component Status: Active; Pad Count: 33; Note: N.A.; Part Number: nPM1300-QEAA; PartId: 102000291; Component Class: Nordic_Devices; Author: eisk; Manufacturer Part Number: nPM1300-QEAA; ComponentLink1URL: N.A.; ComponentLink1Description: Datasheet; ComponentLink2URL: N.A.; ComponentLink2Description: Supplier link; HelpURL: N.A.; LatestRevisionDate: 2023-05-25; Published: 2022-02-17; Footprint Doc: QFN-32; Value: nPM1300-QEAA; Supplier 1: Nordic Semiconductor; Supplier Part Number 1: nPM1300-QEAA; Supplier 2: N.A.; Supplier Part Number 2: N.A.; Artikkelnr Noca: N.A.; Part number IPS: N.A.; Part number Norautron: N.A.

## Sheet Sheet4_Communications.SchDoc
size A4; SheetNumber: 4; SheetTotal: 5
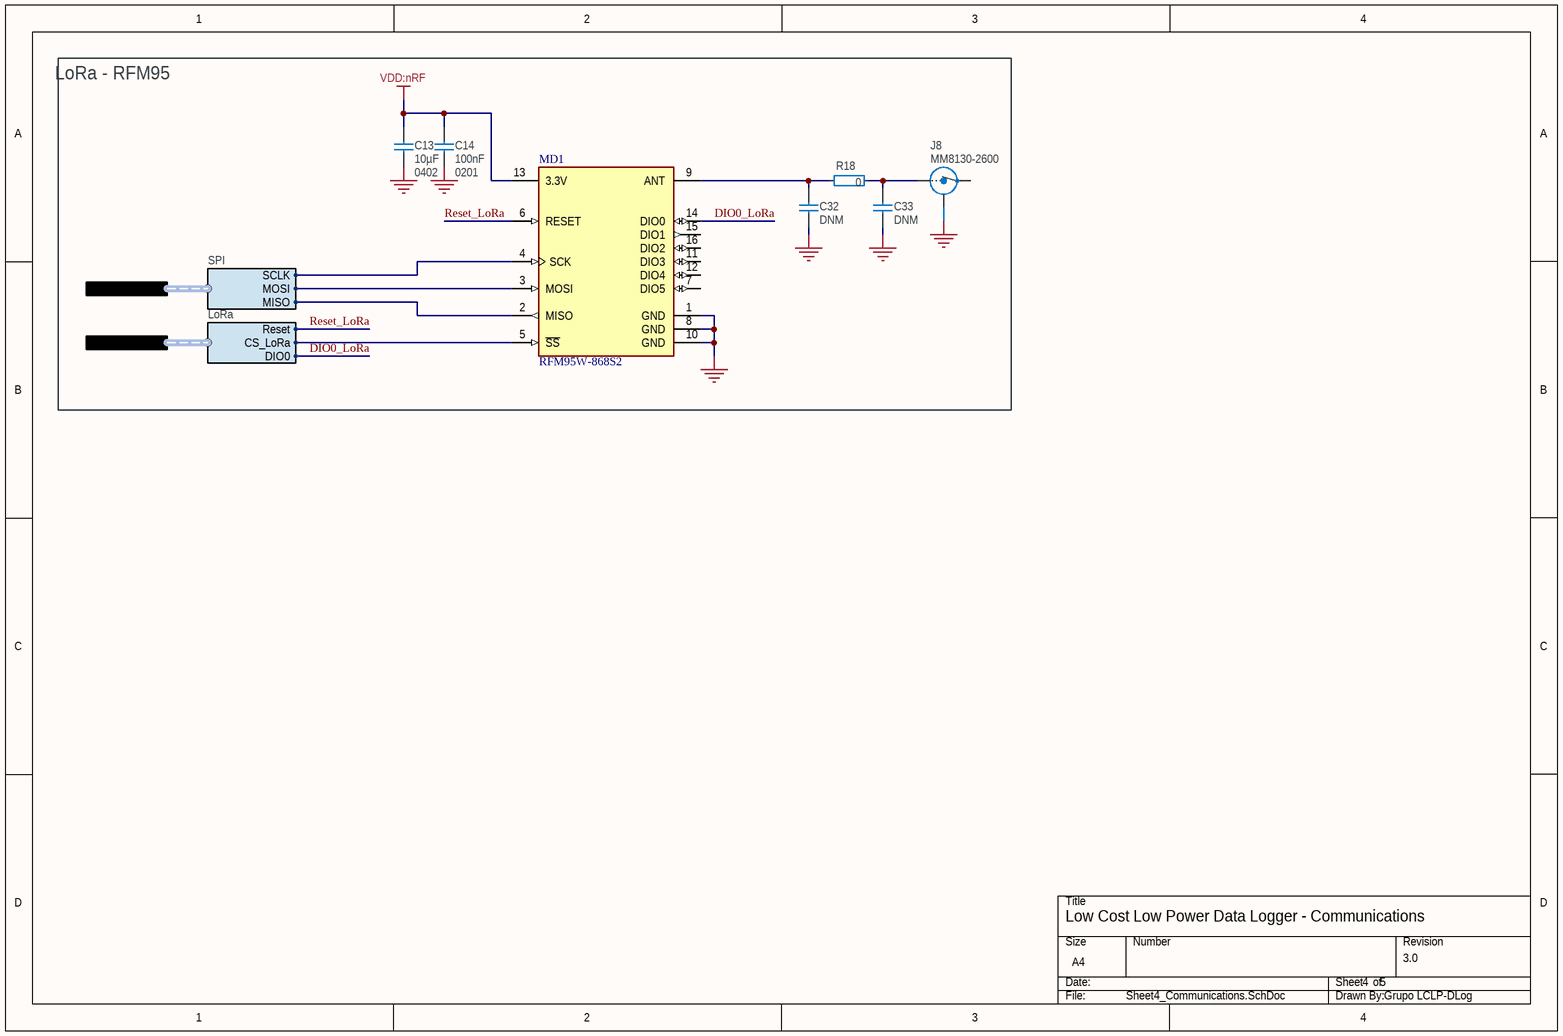
[diagram p3: Sheet4_Communications.SchDoc]

### Parts
C13  10µF  Footprint Doc: 0402  [CAPC1005X04L]
C14  100nF  Footprint Doc: 0201  [CAPC0603X03L_C]
C32  DNM  [CAPC1005X04L_DNM]
C33  DNM  [CAPC1005X04L_DNM]
J8  MM8130-2600  [COAXIAL-SWF]
MD1  RFM95W-868S2  [FP-RFM95W-868S2-MFG]
R18  0  [RESC1005X04L]

### Blocks framed on the sheet
LoRa - RFM95: C13 C14 C32 C33 J8 MD1 R18

### Ports
LoRa_Pins (harness LoRa, see Sheet1_Connections[3C], Sheet2_nRF54L15[4A]), SPI22 (harness SPI, see Sheet1_Connections[3B], Sheet2_nRF54L15[4A], Sheet5_Misc[2A])

### Harnesses
SPI: MISO, MOSI, SCLK
LoRa: DIO0, Reset, CS_LoRa

### Nets
GND: C13.1 C14.2 C32.1 C33.1 J8.2(Shield) MD1.1(GND) MD1.8(GND) MD1.10(GND)
VDD:nRF: C13.2 C14.1 MD1.13(3.3V)
DIO0_LoRa: MD1.14(DIO0) ; port LoRa_Pins.DIO0
P1.07: MD1.5(~{SS}) ; port LoRa_Pins.CS_LoRa
P1.08: MD1.3(MOSI) ; port SPI22.MOSI
P1.09: MD1.4(SCK) ; port SPI22.SCLK
P1.11: MD1.2(MISO) ; port SPI22.MISO
Reset_LoRa: MD1.6(RESET) ; port LoRa_Pins.Reset  [project net P1.10]
NetC32_2: C32.2 MD1.9(ANT) R18.2
NetC33_2: C33.2 J8.1(IN) R18.1

Not connected (* = marked no-connect by the designer): J8 3(OUT); MD1 7(DIO5) 11(DIO3) 12(DIO4) 15(DIO1) 16(DIO2)

### Notes on the sheet
- Low Cost Low Power Data Logger - Communications
- 4
- 5
- 3.0
- Grupo LCLP-DLog

### Library data of the parts
C13 = C0402-10µF-6.3V-X6S: as C3 on sheet Sheet2_nRF54L15; Part Number: C0402-10µF-6.3V-X6S; PartId: 100200478; Component Class: Capacitors; Author: getr; Manufacturer Part Number: N.A.; ComponentLink1URL: N.A.; ComponentLink1Description: Datasheet; ComponentLink2URL: N.A.; ComponentLink2Description: Supplier link; HelpURL: N.A.; LatestRevisionDate: 2021-06-25; Published: 2021-06-25; Value: 10µF; Note: 6.3V; Supplier 1: N.A.; Supplier Part Number 1: N.A.; Supplier 2: N.A.; Supplier Part Number 2: N.A.; Artikkelnr Noca: N.A.; Part number IPS: N.A.; Part number Norautron: N.A.
C14 = C0201-100n-10V-X7R: as C4 on sheet Sheet2_nRF54L15; Part Number: C0201-100n-10V-X7R; Manufacturer Part Number: N.A.; LatestRevisionDate: 2021-04-12; Published: 2021-04-12; Value: 100nF; Artikkelnr Noca: N.A.; Part number IPS: N.A.; ComponentLink1URL: N.A.; ComponentLink1Description: Datasheet; ComponentLink2URL: N.A.; ComponentLink2Description: Supplier link; HelpURL: N.A.; Supplier 1: N.A.; Supplier Part Number 1: N.A.; Supplier 2: N.A.; Supplier Part Number 2: N.A.; Component Class: Capacitors; Author: getr; Part number Norautron: N.A.; PartId: 100200469
C32 C33 = C0402-2µ2-10V: Capacitor, X5R, ±10%; Manufacturer: N.A.; Part number NEMS: 100200376; Component Status: Active; Pad Count: 2; Value: 2.2µF; Note: 10V; Part Number: C0402-2µ2-10V; PartId: 100200376; Component Class: Capacitors; Author: rsk; Manufacturer Part Number: N.A.; ComponentLink1URL: N.A.; ComponentLink1Description: Datasheet; ComponentLink2URL: N.A.; ComponentLink2Description: Supplier link; HelpURL: N.A.; LatestRevisionDate: 2020-10-13; Published: 2016-08-22; Footprint Doc: 0402; Supplier 1: Digi-Key; Supplier Part Number 1: 490-10451-1-ND; Supplier 2: N.A.; Supplier Part Number 2: N.A.; Artikkelnr Noca: N.A.; Part number IPS: N.A.; Part number Norautron: N.A.
J8 = MM8130-2600: as J1 on sheet Sheet2_nRF54L15; Part Number: MM8130-2600; PartId: 100500400; Component Class: Connectors; Author: rsk; Manufacturer Part Number: MM8130-2600; ComponentLink1URL: N.A.; ComponentLink1Description: Datasheet; ComponentLink2URL: N.A.; ComponentLink2Description: Supplier link; HelpURL: http://www.murata.com/products/catalog/pdf/o33e.pdf; LatestRevisionDate: 2014-04-24; Published: 2014-04-24; Footprint Doc: COAXIAL-SWF; Value: MM8130-2600; Supplier 1: Digi-Key; Supplier Part Number 1: 490-4981-1-ND; Supplier 2: Mouser; Supplier Part Number 2: 81-MM8130-2600RA2; System: Connector
MD1 = CMP-00000-1: RFM95W LoRA Transceiver Module 868MHz; Sensitivity (dBm): -123dBm; Min Supply Voltage: 1.8V; Max Junction Temperature (Tj): 125°C; Number of GPIO: 6; Interface: SPI; Data Rate: 300kbps; Nominal Supply Current: 5.8mA; Max Supply Voltage: 3.7V; Current - Receiving: 13.8mA; Current - Transmitting: 120mA; Frequency: 868MHz; Case/Package: SMD/SMT; Height: 1.8mm; Min Operating Temperature: -20°C; Mounting Technology: Surface Mount; Clock Frequency: 868MHz; RoHS: Compliant; Max Operating Temperature: 70°C
R18 = R0201-1k0: as R3 on sheet Sheet2_nRF54L15; Part Number: R0201-1k0; PartId: 100100043; Component Class: Resistors; Author: rsk; Manufacturer Part Number: N.A.; ComponentLink1URL: N.A.; ComponentLink1Description: Datasheet; ComponentLink2URL: N.A.; ComponentLink2Description: Supplier link; HelpURL: N.A.; LatestRevisionDate: 2014-11-13; Published: 2014-11-13; Supplier 1: N.A.; Supplier Part Number 1: N.A.; Supplier 2: N.A.; Supplier Part Number 2: N.A.; Artikkelnr Noca: N.A.; Part number Norautron: N.A.